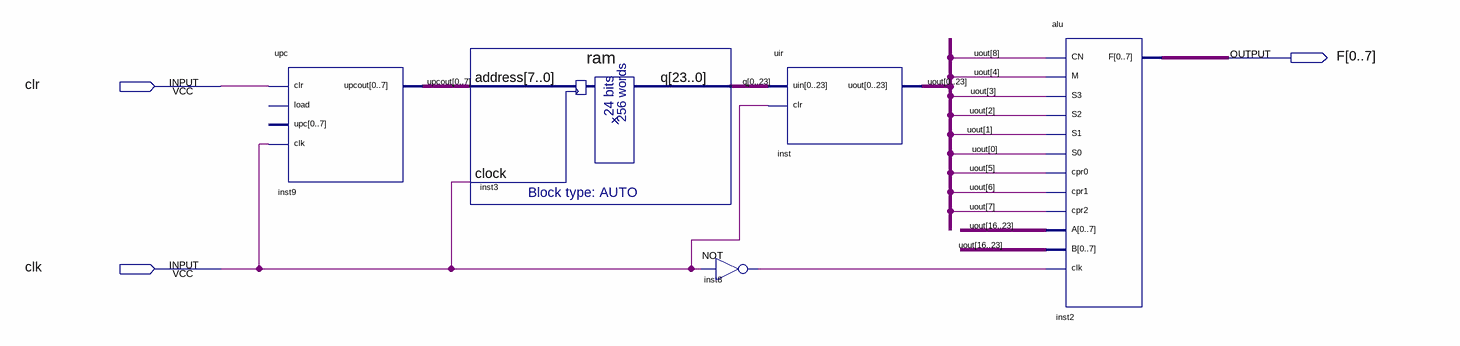
[diagram p0: schematic sheet]
// Quartus schematic backup.bdf as structural Verilog: 5 symbols, 3 pins
module backup (
  input  clr,
  input  clk,
  output [0:7] F
);

  wire inst8_out;
  wire [7:0] upcout;
  wire [23:0] q, uout;

  upc inst9 (
    .clr(clr), .clk(clk),
    .upcout({upcout[0], upcout[1], upcout[2], upcout[3], upcout[4], upcout[5], upcout[6], upcout[7]}));  // open: load, upc
  ram inst3 (
    .address({upcout[0], upcout[1], upcout[2], upcout[3], upcout[4], upcout[5], upcout[6], upcout[7]}),
    .clock(clk),
    .q({q[0], q[1], q[2], q[3], q[4], q[5], q[6], q[7], q[8], q[9], q[10], q[11], q[12], q[13], q[14], q[15], q[16], q[17], q[18], q[19], q[20], q[21], q[22], q[23]}));
  not inst8 (inst8_out, clk);
  uir inst (
    .uin({q[0], q[1], q[2], q[3], q[4], q[5], q[6], q[7], q[8], q[9], q[10], q[11], q[12], q[13], q[14], q[15], q[16], q[17], q[18], q[19], q[20], q[21], q[22], q[23]}),
    .clr(clk),
    .uout({uout[0], uout[1], uout[2], uout[3], uout[4], uout[5], uout[6], uout[7], uout[8], uout[9], uout[10], uout[11], uout[12], uout[13], uout[14], uout[15], uout[16], uout[17], uout[18], uout[19], uout[20], uout[21], uout[22], uout[23]}));
  alu inst2 (
    .CN(uout[8]), .M(uout[4]), .S3(uout[3]), .S2(uout[2]), .S1(uout[1]), .S0(uout[0]), .cpr0(uout[5]),
    .cpr1(uout[6]), .cpr2(uout[7]),
    .A({uout[16], uout[17], uout[18], uout[19], uout[20], uout[21], uout[22], uout[23]}),
    .B({uout[16], uout[17], uout[18], uout[19], uout[20], uout[21], uout[22], uout[23]}), .clk(inst8_out),
    .F(F));
endmodule
